# Altium schematic sheet Channel_4.SchDoc
size A4
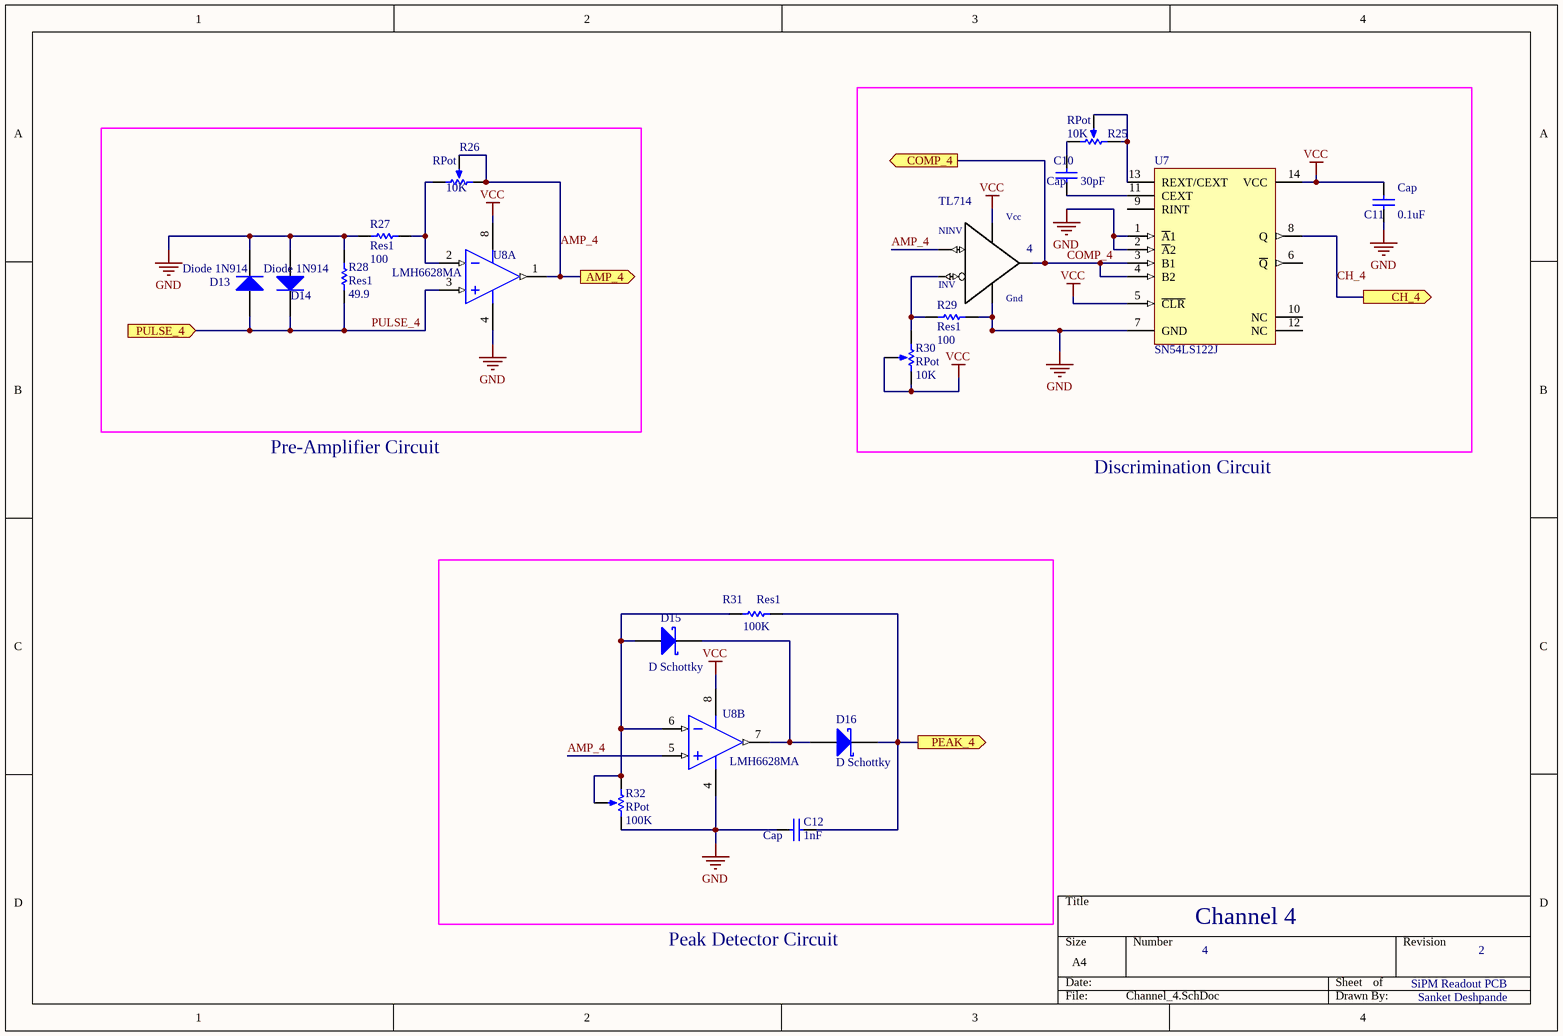
[diagram p0: Channel_4.SchDoc]

## Parts
4  TL714  [SO-08M]
C10  Cap  value 30pF  [RAD-0.3]
C11  Cap  value 0.1uF  [RAD-0.3]
C12  Cap  value 1nF  [RAD-0.3]
D13  Diode 1N914  [DO-35]
D14  Diode 1N914  [DO-35]
D15  D Schottky  [SMB]
D16  D Schottky  [SMB]
R25  RPot  value 10K  [VR5]
R26  RPot  value 10K  [VR5]
R27  Res1  value 100  [AXIAL-0.3]
R28  Res1  value 49.9  [AXIAL-0.3]
R29  Res1  value 100  [AXIAL-0.3]
R30  RPot  value 10K  [VR5]
R31  Res1  value 100K  [AXIAL-0.3]
R32  RPot  value 100K  [VR5]
U7  SN54LS122J  [J014]
U8  LMH6628MA  [M08A_N]  (parts A,B of 2)

## Ports
AMP_4 (out), CH_4 (out), COMP_4 (out), PEAK_4 (out), PULSE_4 (in)

## Nets
GND: 4.5(VNEG) C11.1 C12.1 D13.2(K) D14.1(A) R27.1 R28.1 R29.2 R32.2(BOT) U7.1(~{A}1) U7.2(~{A}2) U7.7(GND) U8.4(V-)
VCC: 4.8(VPOS) C11.2 R30.2(BOT) R30.3(TAP) U7.5(~{CLR}) U7.14(VCC) U8.8(V+)
AMP_4: 4.3(NINV) R26.1(TOP) R26.3(TAP) U8.1(OUT1) U8.5(IN2+) ; port AMP_4
CH_4: U7.8(Q) ; port CH_4
COMP_4: 4.6(OUT) U7.3(B1) U7.4(B2) ; port COMP_4
PEAK_4: C12.2 D16.2(K) R31.2 ; port PEAK_4
PULSE_4: D13.1(A) D14.2(K) R28.2 U8.3(IN1+) ; port PULSE_4
Net4_2: 4.2(INV) R29.1 R30.1(TOP)
NetC10_1: C10.1 U7.11(CEXT)
NetC10_2: C10.2 R25.2(BOT)
NetD15_1: D15.1(A) R31.1 R32.1(TOP) R32.3(TAP) U8.6(IN2-)
NetD15_2: D15.2(K) D16.1(A) U8.7(OUT2)
NetR25_1: R25.1(TOP) R25.3(TAP) U7.13(REXT/CEXT)
NetR26_2: R26.2(BOT) R27.2 U8.2(IN1-)

Not connected (* = marked no-connect by the designer): U7 6(~{Q}) 9(RINT) 10(NC) 12(NC)

## Notes on the sheet
- Pre-Amplifier Circuit
- Discrimination Circuit
- Peak Detector Circuit
- Channel 4
- 4
- SiPM Readout PCB
- 2
- Sanket Deshpande
- (in symbol TL714) Vcc; Gnd

## Library data of the parts
4 = TL714: The TL714C is a high-speed differential comparator fabricated with bipolar Schottky process technology. The circuit h...; MF: Texas Instruments; SnapEDA_Link: https://www.snapeda.com/parts/TL714/Texas%20Instruments/view-part/?ref=snap; Availability: Unavailable; MP: TL714; Package: None; Price: None; Value: *
C10-C12 = Cap: Capacitor; Published: 8-Jun-2000; LatestRevisionDate: 17-Jul-2002; LatestRevisionNote: Re-released for DXP Platform.; PackageReference: RAD-0.3; Publisher: Altium Limited; PackageDescription: Radial Cap, Thru-Hole; 2 Leads; 0.3 in Pin Spacing
D13 D14 = Diode 1N914: High Conductance Fast Diode; Published: 8-Jun-2000; LatestRevisionDate: 17-Jul-2002; LatestRevisionNote: Re-released for DXP Platform.; DatasheetVersion: 1997; PackageReference: DO-35; Publisher: Altium Limited; PackageDescription: Diode, Axial; Body 3.8 x 1.9 mm (LxDia. max), Lead Dia. 0.53 mm (max); Code_JEDEC: DO-204-AH; ComponentLink1Description: Manufacturer Link; ComponentLink1URL: http://www.fairchildsemi.com/; ComponentLink2Description: Datasheet; ComponentLink2URL: http://www.fairchildsemi.com/ds/1N%2F1N4448.pdf
D15 D16 = D Schottky: Schottky Diode; Published: 8-Jun-2000; LatestRevisionDate: 17-Jul-2002; LatestRevisionNote: Re-released for DXP Platform.; PackageReference: SMB; Publisher: Altium Limited; PackageDescription: DO-214-AA/SMB; 2 C-Bend Leads; Body 5.3 x 3.6 mm, inc. leads (LxW); Code_JEDEC: DO-214-AA
R25 R26 R30 R32 = RPot: Potentiometer; Sim Note: Enter the Resistance value and the set point into parameter fields.; Set Position: 0.5; Published: 8-Jun-2000; LatestRevisionDate: 17-Jul-2002; LatestRevisionNote: Re-released for DXP Platform.; PackageReference: VR5; Publisher: Altium Limited; PackageDescription: Variable Resistor, Thru-Hole; 3 Leads
R27-R29 R31 = Res1: Resistor; Published: 8-Jun-2000; LatestRevisionDate: 17-Jul-2002; LatestRevisionNote: Re-released for DXP Platform.; PackageReference: AXIAL-0.3; Publisher: Altium Limited; PackageDescription: Axial Device, Thru-Hole; 2 Leads; 0.3 in Pin Spacing
U7 = SN54LS122J: Retriggerable Monostable Multivibrator; Note: Pins No 10 and 12 are not connected and not drawn; Published: 8-Jun-2000; LatestRevisionDate: 04-Mar-2005; LatestRevisionNote: Stylized 3D Model Added.; DatasheetVersion: Mar-1988; PackageVersion: Jun-1999; PackageReference: J014; Publisher: Altium Limited; PackageDescription: DIP; 14 Leads; Row Spacing 7.62 mm; Pitch 2.54 mm; ComponentLink1Description: Manufacturer Link; ComponentLink1URL: http://www.ti.com/; ComponentLink2Description: Datasheet; ComponentLink2URL: http://www-s.ti.com/sc/ds/sn54ls123.pdf
U8 = LMH6628MA: Dual Wideband, Low Noise, Voltage Feedback Op Amp, 8-pin Narrow SOIC; Manufacturer: National Semiconductor; PackageTopMarking: NSZXTT*LMH66*28MA; PowerWise: Y; CompType: Amplifiers; DatasheetVersion: May-2005; PackageVersion: revM, May-2009; PackageReference: M08A; PackageDescription: SOIC Narrow, 4.9 x 3.9 x 1.45mm, 8 Lead, 1.27mm Pitch; PartNumber: LMH6628MA; RoHS: N; PinCount: 8; High-Reliability: Y; Code_JEDEC: MS-012-AA; Code_IPC: SOIC127P600-8; ComponentLink1Description: Manufacturer URL; ComponentLink1URL: http://www.national.com/; ComponentLink2Description: LMH6628 Datasheet; ComponentLink2URL: http://www.national.com/ds/LM/LMH6628.pdf; ComponentLink3Description: LMH6628 Web Page; ComponentLink3URL: http://www.national.com/pf/LM/LMH6628.html; ComponentLink4Description: M08A Package Page; ComponentLink4URL: http://www.national.com/packaging/folders/m08a.html